# EAGLE design RS232-Board (EAGLE 7.7.0)
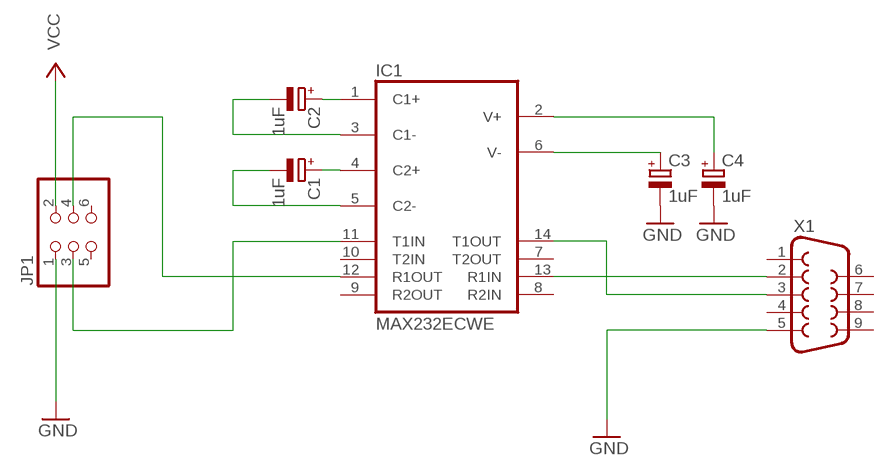
[diagram p0: schematic, sheet 1]

## Parts
C1  1uF  CPOL-EUE2,5-6E  [E2,5-6E]
C2  1uF  CPOL-EUE2,5-6E  [E2,5-6E]
C3  1uF  CPOL-EUE2,5-6E  [E2,5-6E]
C4  1uF  CPOL-EUE2,5-6E  [E2,5-6E]
IC1  MAX232ECWE  [SO16L]
JP1  PINHD-2X3  [2X03]
X1  F09H  [F09H]

## Nets
GND: C3.- C4.- JP1.1 X1.5
N$1: C1.+ IC1.4(C2+)
N$2: C1.- IC1.5(C2-)
N$3: IC1.13(R1IN) X1.2
N$4: C2.- IC1.3(C1-)
N$5: C2.+ IC1.1(C1+)
N$6: C3.+ IC1.6(V-)
N$7: C4.+ IC1.2(V+)
N$8: IC1.14(T1OUT) X1.3
N$14: IC1.12(R1OUT) JP1.4
N$15: IC1.11(T1IN) JP1.3
VCC: JP1.2
Unconnected: IC1.7(T2OUT) IC1.8(R2IN) IC1.9(R2OUT) IC1.10(T2IN) JP1.5 JP1.6 X1.1 X1.4 X1.6 X1.7 X1.8 X1.9

## Power pins joined to a net without a drawn wire
GND: IC1.15(GND)
VCC: IC1.16(VCC)

## Library data of the parts
C1-C4 = rcl:CPOL-EU: POLARIZED CAPACITOR, European symbol
IC1 = maxim:MAX232ECWE: RS232 TRANSCEIVER; MF: MAXIM; MPN: MAX232ECWE+; OC_FARNELL: 9724435; OC_NEWARK: 67K4440
JP1 = pinhead:PINHD-2X3: PIN HEADER
X1 = con-subd:F09: SUB-D; OC_FARNELL: unknown; OC_NEWARK: unknown

## Board
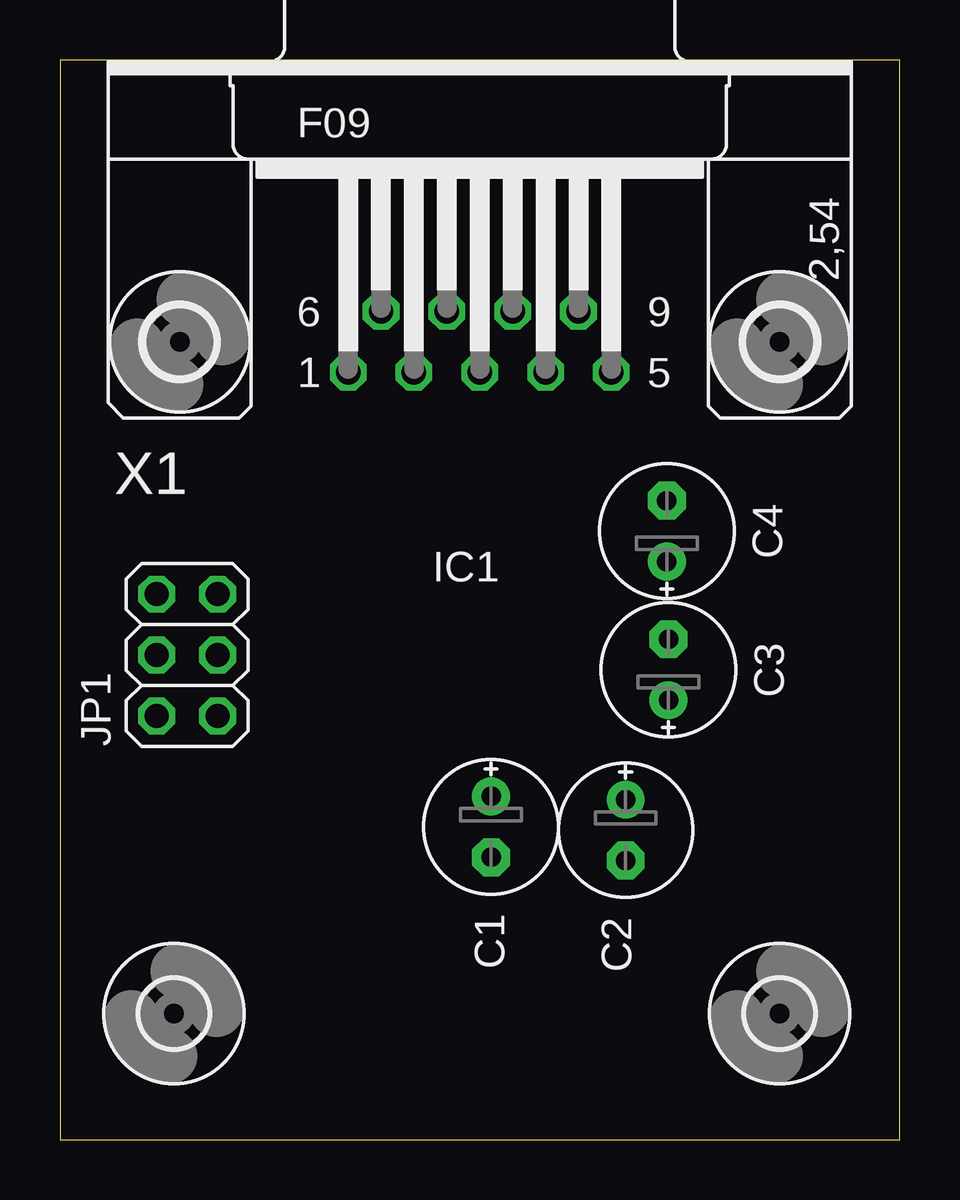
[diagram p1: board, top side]
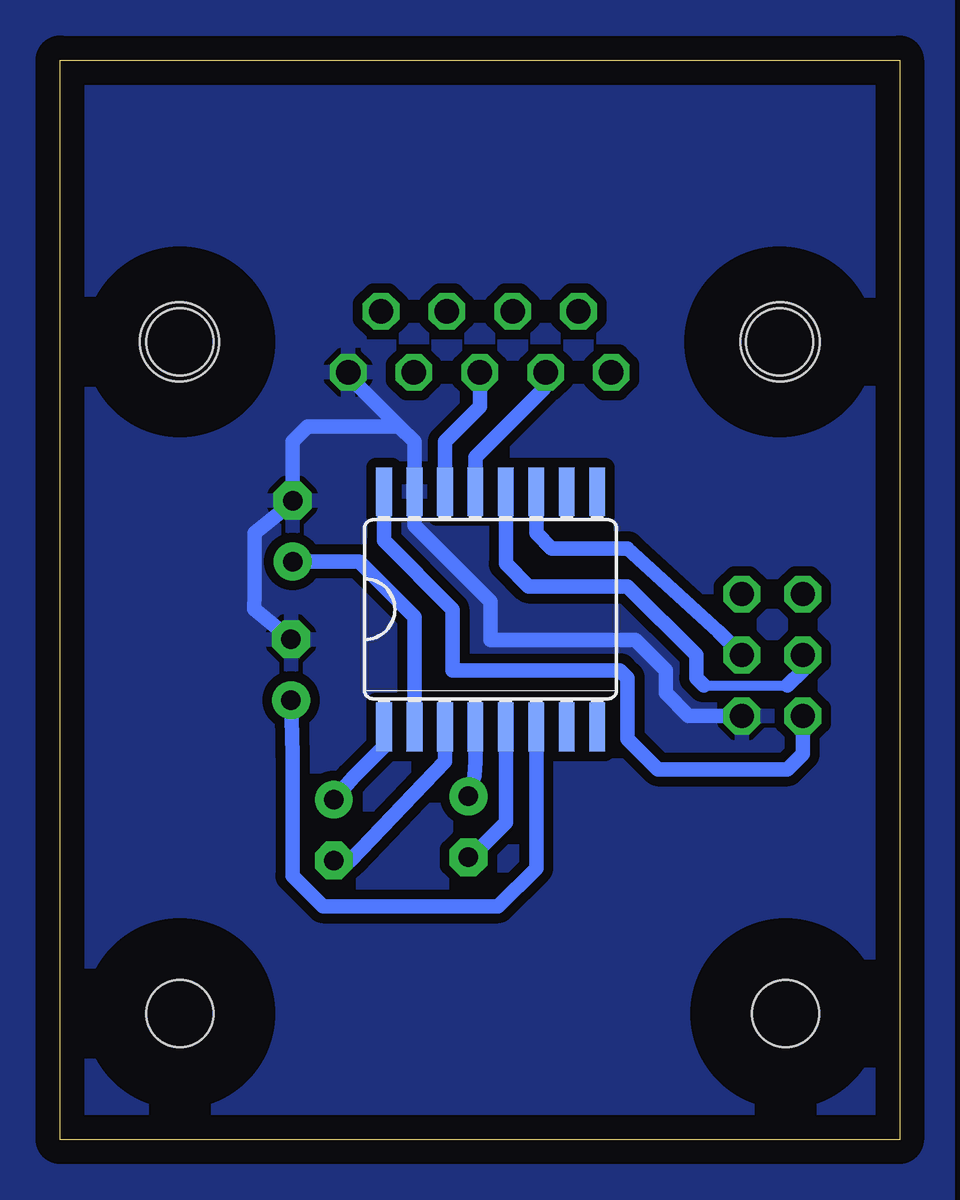
[diagram p2: board, bottom side, seen from below]

Size 35 x 45 mm. Coordinates in mm from the lower left corner, seen from the top.
Outline: 0,0 35,0 35,45 0,45 0,0
Copper layers (1*16): Top 0.035mm / dielectric 1.5mm / Bottom 0.035mm
Design rules "default": minimum track width 10mil, minimum drill 24mil, track to track 8mil, track to pad 8mil, pad to pad 8mil, via to via 8mil, smd to smd 8mil, copper to edge 40mil, drill to drill 8mil, minimum pad ring 10mil, minimum via ring 8mil, stop-mask expansion 4mil, vias tented up to drill 0mil, thermal gap 10mil

### Footprints (pad centres in the part's own frame; a part is rotated, then mirrored left to right if it is on the bottom)
E2,5-6E = drill 0.813 pad 1.575: + -1.27,0 | drill 0.813 pad 1.575 octagon: - 1.27,0
SO16L = smd 0.66 x 2.032: 1 -4.445,-4.902; 2 -3.175,-4.902; 3 -1.905,-4.902; 4 -0.635,-4.902; 5 0.635,-4.902; 6 1.905,-4.902; 7 3.175,-4.902; 8 4.445,-4.902; 9 4.445,4.902; 10 3.175,4.902; 11 1.905,4.902; 12 0.635,4.902; 13 -0.635,4.902; 14 -1.905,4.902; 15 -3.175,4.902; 16 -4.445,4.902
2X03 = drill 1.016 octagon: 1 -2.54,-1.27; 2 -2.54,1.27; 3 0,-1.27; 4 0,1.27; 5 2.54,-1.27; 6 2.54,1.27
2,8 = hole 2.8: 0,0
F09H = drill 1.016 octagon: 1 -5.486,-1.27; 2 -2.743,-1.27; 3 0,-1.27; 4 2.743,-1.27; 5 5.486,-1.27; 6 -4.115,1.27; 7 -1.372,1.27; 8 1.372,1.27; 9 4.115,1.27 | hole 3.302: -12.522,0; 12.522,0

### Placement (x,y rotation side)
C1  17.97,13.03 270 top
C2  23.58,12.9 270 top
C3  25.37,19.58 90 top
C4  25.3,25.36 90 top
IC1  17.05,22.1 0 bottom
JP1  5.3,20.2 90 top
U$1  [2,8]  5,33.25 0 top
U$2  [2,8]  30,33.25 0 top
U$3  [2,8]  4.75,5.25 0 top
U$4  [2,8]  30,5.25 0 top
X1  17.5,33.25 0 top

### Tracks (layer width: path | path; a pad name or v marks a point on that pad's centre or on a via)
GND
  Bottom 0.61: 20.86,29.72 20.23,29.09 IC1.15 20.23,25.59 17.05,22.42 17.05,20.83 11.02,20.83 9.75,19.56 9.75,18.61 8.79,17.66 JP1.1 | 20.86,29.72 22.99,31.85 X1.5 | 20.86,29.72 24.67,29.72 25.3,29.09 25.3,27.91 C4.- 25.7,26.23 26.89,25.28 26.89,22.74 26.91,22.12 C3.-
  pour Bottom (isolate 0.406): -1.05,46.23 36.73,46.23 36.73,-1.71 -0.73,-1.71 -1.05,-1.71
N$1
  Bottom 0.61: C1.+ 17.71,15.15 17.68,15.75 IC1.4
N$2
  Bottom 0.61: C1.- 17.55,12.08 16.41,13.21 IC1.5
N$3
  Bottom 0.61: IC1.13 17.68,28.45 14.83,31.31 14.83,31.91 X1.2
N$4
  Bottom 0.61: IC1.3 18.95,15.75 22.91,11.62 C2.-
N$5
  Bottom 0.61: C2.+ 22.77,15.11 21.5,16.39 IC1.1
N$6
  Bottom 0.61: C3.+ 25.3,16.02 25.3,10.99 24.04,9.72 16.73,9.72 15.14,11.31 IC1.6
N$7
  Bottom 0.61: IC1.2 20.23,21.78 22.53,24.09 C4.+
N$8
  Bottom 0.61: IC1.14 18.95,29.09 17.5,30.54 X1.3
N$9
  pour Bottom (isolate 0.406): -2,47.5 38.96,47.5 38.96,-3.93 -2,-3.93
N$14
  Bottom 0.406: 8.16,18.93 4.67,18.93
  Bottom 0.61: IC1.12 16.41,24.01 15.46,23.05 11.34,23.05 8.48,20.2 8.48,19.24 8.16,18.93 | 4.67,18.93 4.03,19.56 JP1.4
N$15
  Bottom 0.61: JP1.3 7.53,21.15 11.34,24.64 14.51,24.64 15.14,25.28 IC1.11
VCC
  Bottom 0.61: IC1.16 21.5,24.96 18.64,22.1 18.64,19.56 11.65,19.56 11.34,19.24 11.34,16.7 10.06,15.44 4.67,15.44 4.03,16.07 JP1.2